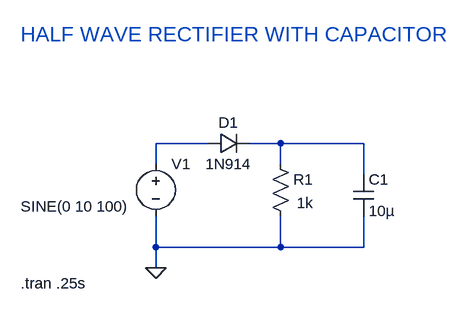
[diagram p0: schematic 4)hwr_with_capacitor.asc]
4)hwr_with_capacitor.asc, the LTspice schematic file:
Version 4
SHEET 1 880 680
WIRE 128 112 48 112
WIRE 240 112 192 112
WIRE 368 112 240 112
WIRE 48 144 48 112
WIRE 240 144 240 112
WIRE 368 160 368 112
WIRE 48 272 48 224
WIRE 240 272 240 224
WIRE 240 272 48 272
WIRE 368 272 368 224
WIRE 368 272 240 272
WIRE 48 304 48 272
FLAG 48 304 0
SYMBOL voltage 48 128 R0
WINDOW 3 -208 81 Left 2
WINDOW 123 0 0 Left 0
WINDOW 39 0 0 Left 0
SYMATTR Value SINE(0 10 100)
SYMATTR InstName V1
SYMBOL diode 128 128 R270
WINDOW 0 32 32 VTop 2
WINDOW 3 0 32 VBottom 2
SYMATTR InstName D1
SYMATTR Value 1N914
SYMBOL res 224 128 R0
WINDOW 3 41 76 Left 2
SYMATTR Value 1k
SYMATTR InstName R1
SYMBOL cap 352 160 R0
SYMATTR InstName C1
SYMATTR Value 10µ
TEXT -160 328 Left 2 !.tran .25s
TEXT -160 -56 Left 3 ;HALF WAVE RECTIFIER WITH CAPACITOR

The netlist it stands for:
* 4)hwr_with_capacitor.asc
V1 N001 0 SINE(0 10 100)
D1 N001 N002 1N914
R1 N002 0 1k
C1 N002 0 10µ
.model D D
.lib standard.dio
.tran .25s
* HALF WAVE RECTIFIER WITH CAPACITOR
.backanno
.end